# EAGLE schematic ECG (EAGLE 7.4.0)
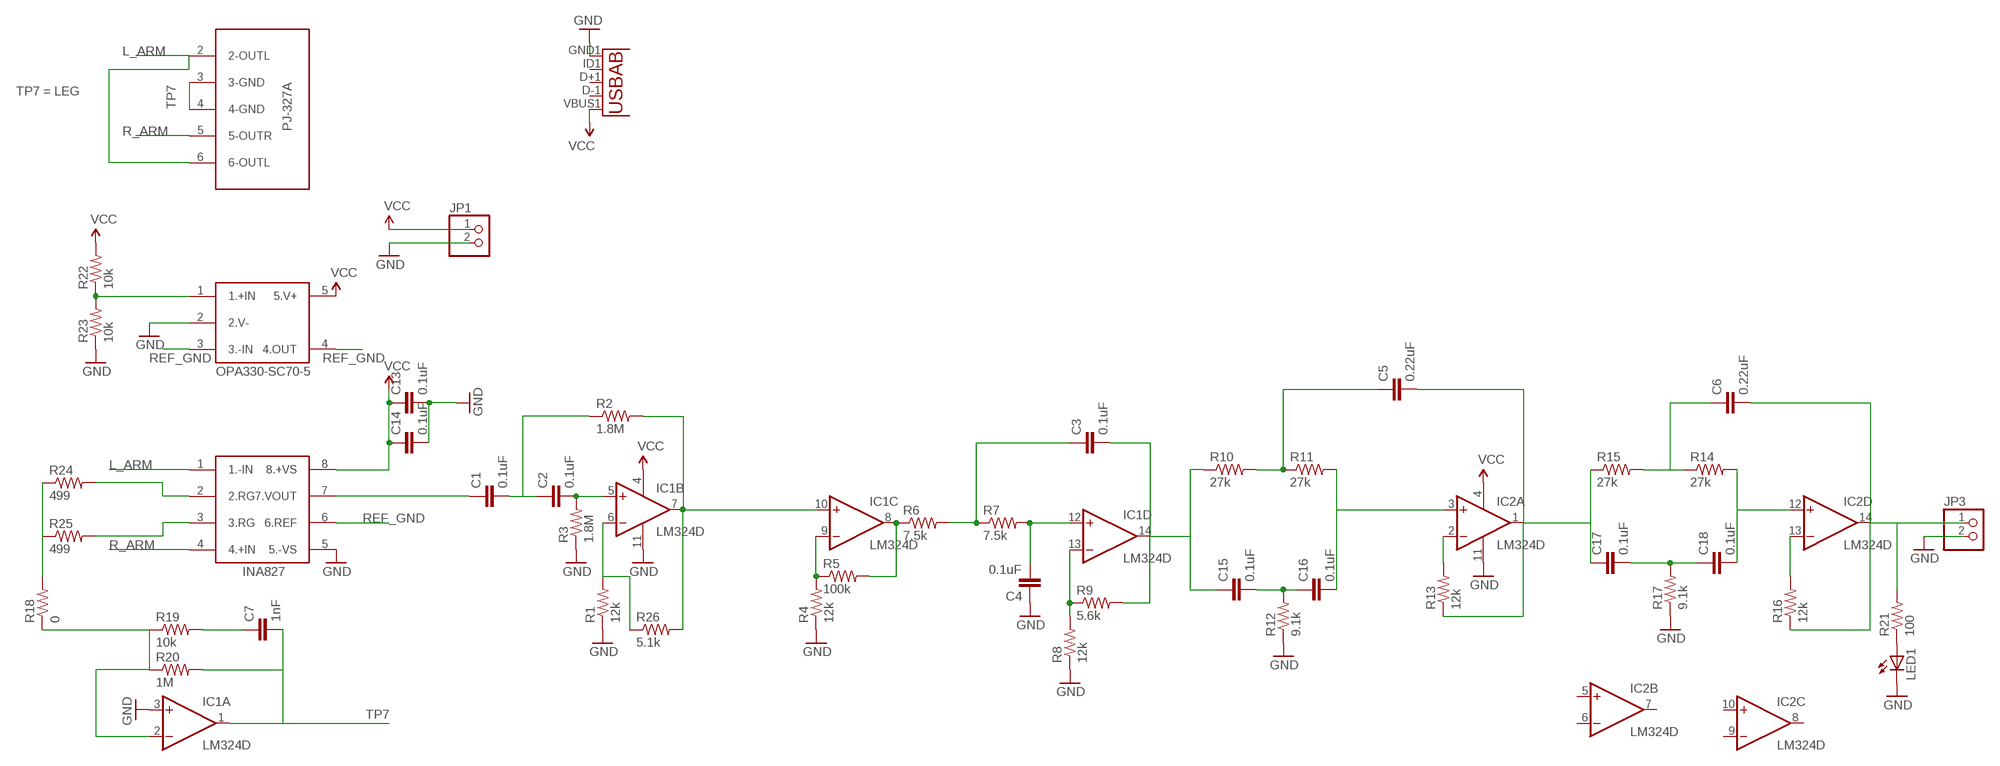
[diagram p0: schematic, sheet 1]

## Parts
C1  0.1uF  0.22UF-25V-10%(0603)  [0603-CAP]
C2  0.1uF  0.22UF-25V-10%(0603)  [0603-CAP]
C3  0.1uF  0.22UF-25V-10%(0603)  [0603-CAP]
C4  0.1uF  0.22UF-25V-10%(0603)  [0603-CAP]
C5  0.22uF  0.22UF-25V-10%(0603)  [0603-CAP]
C6  0.22uF  0.22UF-25V-10%(0603)  [0603-CAP]
C7  1nF  0.22UF-25V-10%(0603)  [0603-CAP]
C13  0.1uF  0.22UF-25V-10%(0603)  [0603-CAP]
C14  0.1uF  0.22UF-25V-10%(0603)  [0603-CAP]
C15  0.1uF  0.22UF-25V-10%(0603)  [0603-CAP]
C16  0.1uF  0.22UF-25V-10%(0603)  [0603-CAP]
C17  0.1uF  0.22UF-25V-10%(0603)  [0603-CAP]
C18  0.1uF  0.22UF-25V-10%(0603)  [0603-CAP]
IC1  LM324D  [SO14]
IC2  LM324D  [SO14]
JP1  PINHD-1X2  [1X02]
JP3  PINHD-1X2  [1X02]
LED1  LEDCHIPLED_0603  [CHIPLED_0603]
R1  12k  1.2MOHMS-1/10W-1%(0603)  [0603-RES]
R2  1.8M  1.2MOHMS-1/10W-1%(0603)  [0603-RES]
R3  1.8M  1.2MOHMS-1/10W-1%(0603)  [0603-RES]
R4  12k  1.2MOHMS-1/10W-1%(0603)  [0603-RES]
R5  100k  1.2MOHMS-1/10W-1%(0603)  [0603-RES]
R6  7.5k  1.2MOHMS-1/10W-1%(0603)  [0603-RES]
R7  7.5k  1.2MOHMS-1/10W-1%(0603)  [0603-RES]
R8  12k  1.2MOHMS-1/10W-1%(0603)  [0603-RES]
R9  5.6k  1.2MOHMS-1/10W-1%(0603)  [0603-RES]
R10  27k  1.2MOHMS-1/10W-1%(0603)  [0603-RES]
R11  27k  1.2MOHMS-1/10W-1%(0603)  [0603-RES]
R12  9.1k  1.2MOHMS-1/10W-1%(0603)  [0603-RES]
R13  12k  1.2MOHMS-1/10W-1%(0603)  [0603-RES]
R14  27k  1.2MOHMS-1/10W-1%(0603)  [0603-RES]
R15  27k  1.2MOHMS-1/10W-1%(0603)  [0603-RES]
R16  12k  1.2MOHMS-1/10W-1%(0603)  [0603-RES]
R17  9.1k  1.2MOHMS-1/10W-1%(0603)  [0603-RES]
R18  0  1.2MOHMS-1/10W-1%(0603)  [0603-RES]
R19  10k  1.2MOHMS-1/10W-1%(0603)  [0603-RES]
R20  1M  1.2MOHMS-1/10W-1%(0603)  [0603-RES]
R21  100  1.2MOHMS-1/10W-1%(0603)  [0603-RES]
R22  10k  1.2MOHMS-1/10W-1%(0603)  [0603-RES]
R23  10k  1.2MOHMS-1/10W-1%(0603)  [0603-RES]
R24  499  1.2MOHMS-1/10W-1%(0603)  [0603-RES]
R25  499  1.2MOHMS-1/10W-1%(0603)  [0603-RES]
R26  5.1k  1.2MOHMS-1/10W-1%(0603)  [0603-RES]
U1  USB""  [USB-MICRO-SMD]
U$1  OPA330-SC70-5  [OPA330-SC70-5]
U$2  INA827  [INA827]
U$3  PJ-327A  [PJ-327A]

## Nets
GND: C4.1 C13.2 C14.2 IC1.3(A:+IN) IC1.11(P:V-) IC2.11(P:V-) JP1.2 JP3.2 LED1.C R1.1 R3.1 R4.1 R8.1 R12.1 R17.1 R23.1 U1.GND1(GND) U$1.2(2.V-) U$2.5(5.-VS)
L_ARM: U$2.1(1.-IN) U$3.2(2-OUTL) U$3.6(6-OUTL)
N$1: R22.1 R23.2 U$1.1(1.+IN)
N$2: R24.2 U$2.2(2.RG)
N$3: R25.2 U$2.3(3.RG)
N$4: C2.2 IC1.5(B:+IN) R3.2
N$5: C1.1 U$2.7(7.VOUT)
N$6: C1.2 C2.1 R2.1
N$7: IC1.7(B:OUT) IC1.10(C:+IN) R2.2 R26.2
N$8: IC1.6(B:-IN) R1.2 R26.1
N$9: C3.1 R6.2 R7.1
N$10: IC1.9(C:-IN) R4.2 R5.1
N$11: IC1.8(C:OUT) R5.2 R6.1
N$12: C4.2 IC1.12(D:+IN) R7.2
N$13: C3.2 C15.1 IC1.14(D:OUT) R9.2 R10.1
N$14: IC1.13(D:-IN) R8.2 R9.1
N$15: C5.1 R10.2 R11.1
N$16: C16.2 IC2.3(A:+IN) R11.2
N$17: C15.2 C16.1 R12.2
N$18: IC2.2(A:-IN) R13.2
N$19: C5.2 C17.1 IC2.1(A:OUT) R13.1 R15.1
N$20: IC2.13(D:-IN) R16.2
N$21: C17.2 C18.1 R17.2
N$22: C18.2 IC2.12(D:+IN) R14.2
N$23: C6.1 R14.1 R15.2
N$24: C6.2 IC2.14(D:OUT) JP3.1 R16.1 R21.2
N$25: R18.2 R24.1 R25.1
N$26: IC1.2(A:-IN) R18.1 R19.1 R20.1
N$27: C7.1 R19.2
N$37: LED1.A R21.1
R_ARM: U$2.4(4.+IN) U$3.5(5-OUTR)
REF_GND: U$1.3(3.-IN) U$1.4(4.OUT) U$2.6(6.REF)
TP7: C7.2 IC1.1(A:OUT) R20.2 U$3.3(3-GND) U$3.4(4-GND)
VCC: C13.1 C14.1 IC1.4(P:V+) IC2.4(P:V+) JP1.1 R22.2 U1.VBUS1(VBUS) U$1.5(5.V+) U$2.8(8.+VS)
Unconnected: IC2.5(B:+IN) IC2.6(B:-IN) IC2.7(B:OUT) IC2.8(C:OUT) IC2.9(C:-IN) IC2.10(C:+IN) U1.D+1(D+) U1.D-1(D-) U1.ID1(USBID)

## Notes on the sheet
- TP7 = LEG

## Library data of the parts
C1-C4 C7 C13-C18 = SparkFun-Capacitors:0.22UF-25V-10%(0603): CAP-07822; PROD_ID: CAP-07822; VALUE: 0.22uF
C5 C6 = SparkFun-Capacitors:0.22UF-25V-10%(0603): CAP-07822; PROD_ID: CAP-07822
IC1 IC2 = linear:LM324: OP AMP
JP1 JP3 = pinhead:PINHD-1X2: PIN HEADER
LED1 = adafruit:LED: LED OSRAM: - CHIPLED LG R971, LG N971, LY N971, LG Q971, LY Q971, LO R971, LY R971 LH N974, LH R974 LS Q976, LO Q976, LY Q976 LO Q996 - Hyper CHIPLED LW Q18S LB Q993, LB Q99A, LB R99A - SideLED LS A670, LO A670, LY A670, LG A670, LP A670 LB A673, LV A673, LT A673, LW A673 LH A674 LY A675 LS A676, LA A676, LO A676, LY A676, LW A676 LS A679, LY A679, LG A679 - Hyper Micro SIDELED® LS Y876, LA Y876, LO Y876, LY Y876 LT Y87S - SmartLED LW L88C, LW L88S LB L89C, LB L89S, LG L890 LS L89K, LO L89K, LY L89K LS L896, LA L896, LO L896, LY L896 - TOPLED LS T670, LO T670, LY T670, LG T670, LP T670 LSG T670, LSP T670, LSY T670, LOP T670, LYG T670 LG T671, LOG T671, LSG T671 LB T673, LV T673, LT T673, LW T673 LH T674 LS T676, LA T676, LO T676, LY T676, LB T676, LH T676, LSB T676, LW T676 LB T67C, LV T67C, LT T67C, LS T67K, LO T67K, LY T67K, LW E67C LS E67B, LA E67B, LO E67B, LY E67B, LB E67C, LV E67C, LT E67C LW T67C LS T679, LY T679, LG T679 LS T770, LO T770, LY T770, LG T770, LP T770 LB T773, LV T773, LT T773, LW T773 LH T774 LS E675, LA E675, LY E675, LS T675 LS T776, LA T776, LO T776, LY T776, LB T776 LHGB T686 LT T68C, LB T68C - Hyper Mini TOPLED® LB M676 - Mini TOPLED Santana® LG M470 LS M47K, LO M47K, LY M47K Source: http://www.osram.convergy.de/
R1-R26 = SparkFun-Resistors:1.2MOHMS-1/10W-1%(0603): RES-10055; PROD_ID: RES-10055; VALUE: 1.2M
U1 = MicroUSB:USB: This is a USB AB connector that is compatible with USB OTG. i.e. this connector can serve as a host or device
U$1 = OPA330:OPA330-SC70-5
U$2 = INA827:INA827
U$3 = PJ-327A:PJ-327A